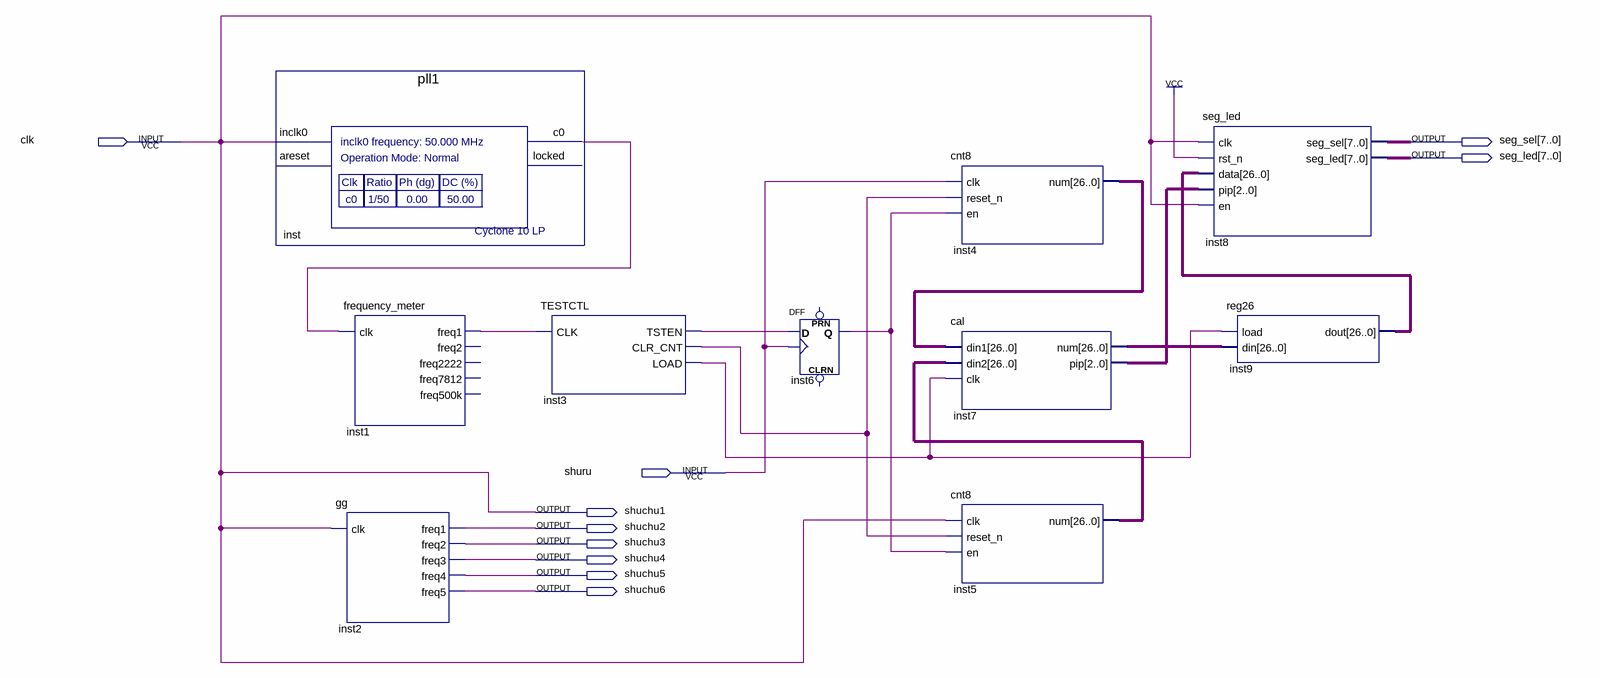
[diagram p0: schematic sheet]
// Quartus schematic freq.bdf as structural Verilog: 10 symbols, 10 pins
module freq (
  input  clk,
  input  shuru,
  output [7:0] seg_sel,
  output [7:0] seg_led,
  output shuchu1,
  output shuchu2,
  output shuchu3,
  output shuchu4,
  output shuchu5,
  output shuchu6
);

  wire inst1_freq1, inst3_clr_cnt, inst3_load, inst3_tsten, inst6_q, inst_c0;
  wire [2:0] inst7_pip;
  wire [26:0] inst4_num, inst5_num, inst7_num, inst9_dout;

  pll1 inst (.inclk0(clk), .c0(inst_c0));  // open: areset, locked
  frequency_meter inst1 (.clk(inst_c0), .freq1(inst1_freq1));  // open: freq2, freq2222, freq7812, freq500k
  gg inst2 (.clk(clk), .freq1(shuchu2), .freq2(shuchu3), .freq3(shuchu4), .freq4(shuchu5), .freq5(shuchu6));
  TESTCTL inst3 (.CLK(inst1_freq1), .TSTEN(inst3_tsten), .CLR_CNT(inst3_clr_cnt), .LOAD(inst3_load));
  DFF inst6 (.CLK(shuru), .D(inst3_tsten), .Q(inst6_q));  // open: CLRN, PRN
  cnt8 inst4 (.clk(shuru), .reset_n(inst3_clr_cnt), .en(inst6_q), .num(inst4_num));
  cal inst7 (.din1(inst4_num), .din2(inst5_num), .clk(inst3_load), .num(inst7_num), .pip(inst7_pip));
  cnt8 inst5 (.clk(clk), .reset_n(inst3_clr_cnt), .en(inst6_q), .num(inst5_num));
  seg_led inst8 (
    .clk(clk), .rst_n(1'b1), .data(inst9_dout), .pip(inst7_pip), .en(clk), .seg_sel(seg_sel),
    .seg_led(seg_led));
  reg26 inst9 (.load(inst3_load), .din(inst7_num), .dout(inst9_dout));

  assign shuchu1 = clk;
endmodule
